# Altium schematic sheet Sheet1.SchDoc
size A2; SheetNumber: 1; SheetTotal: 1
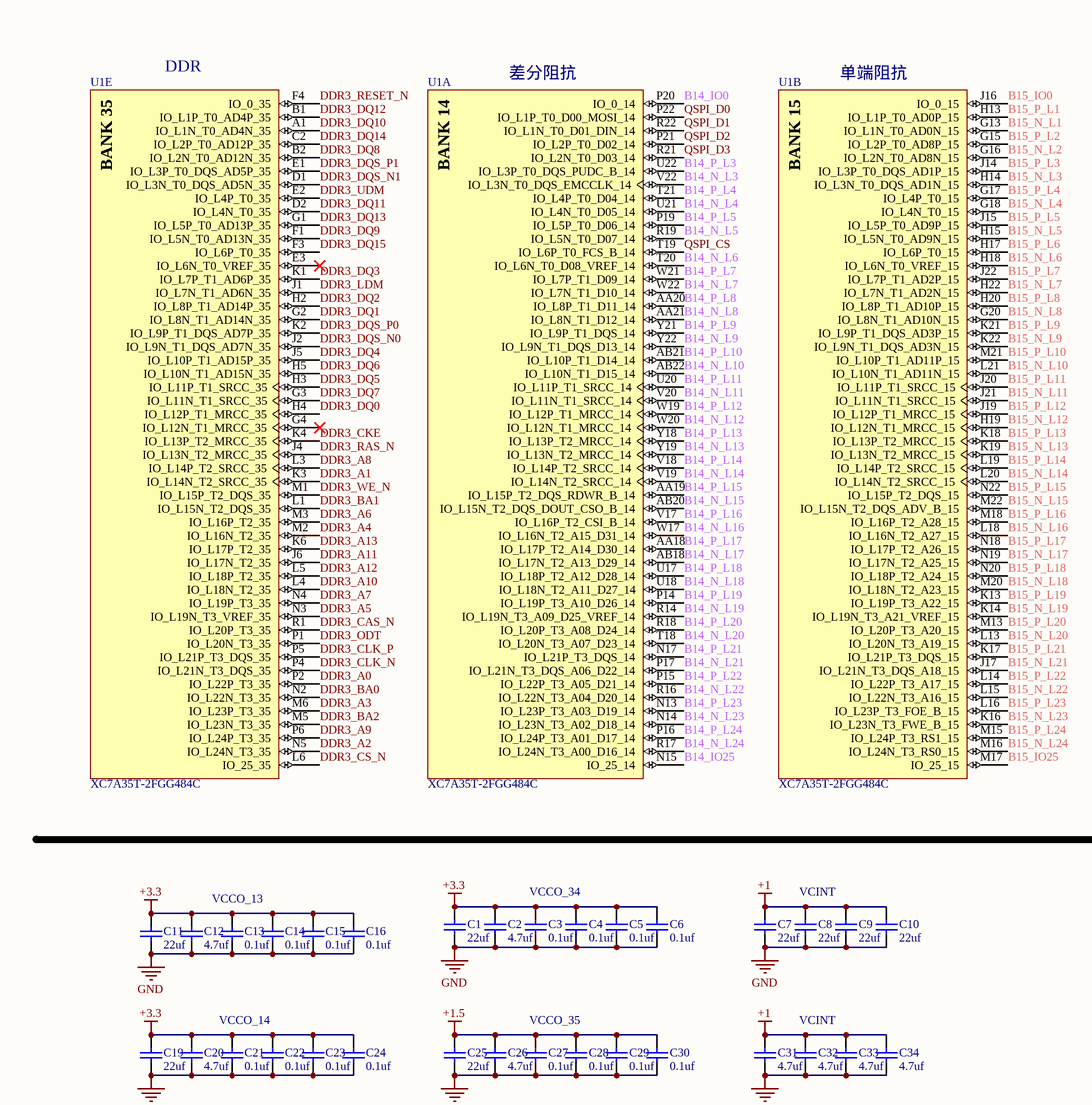
[diagram p0: Sheet1.SchDoc, top left]
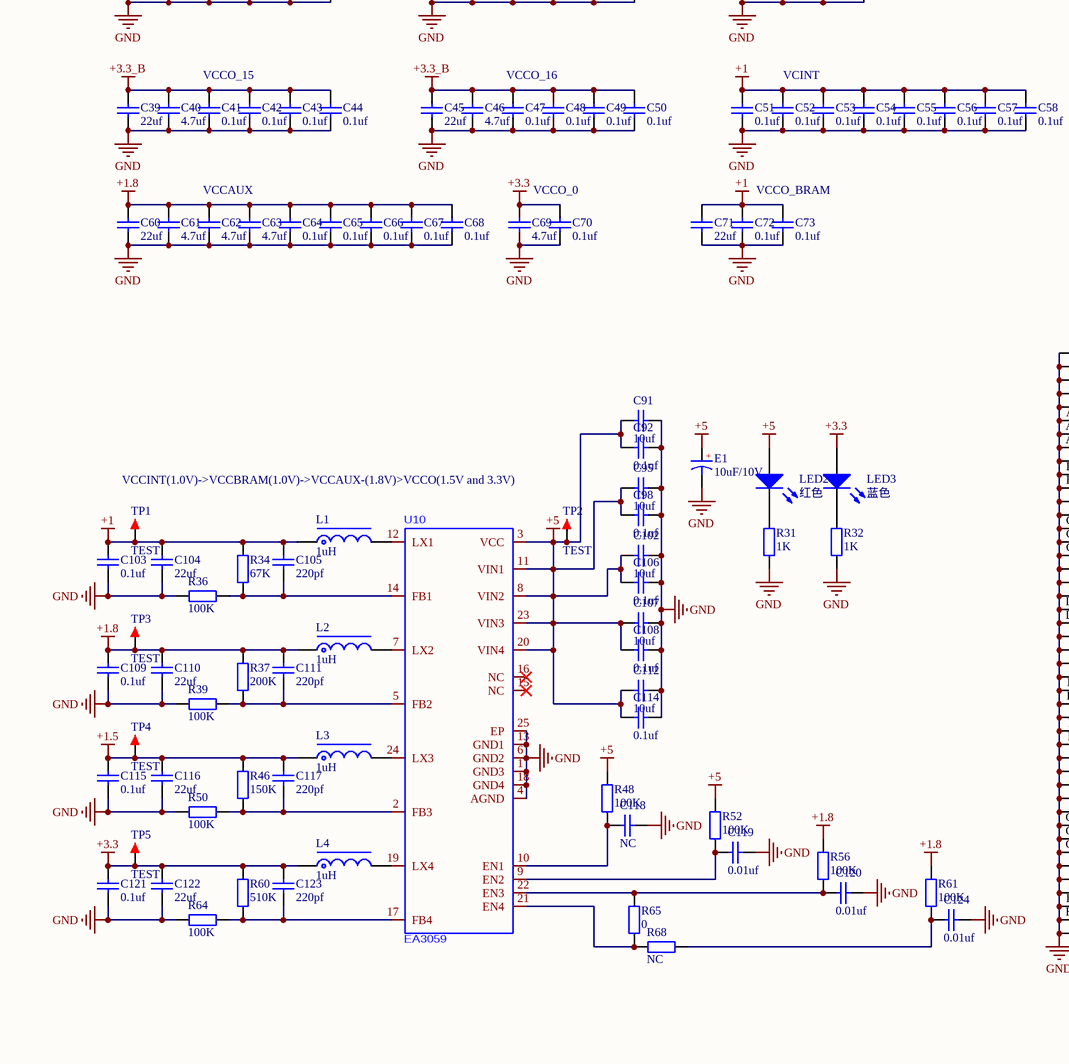
[diagram p1: Sheet1.SchDoc, bottom left]
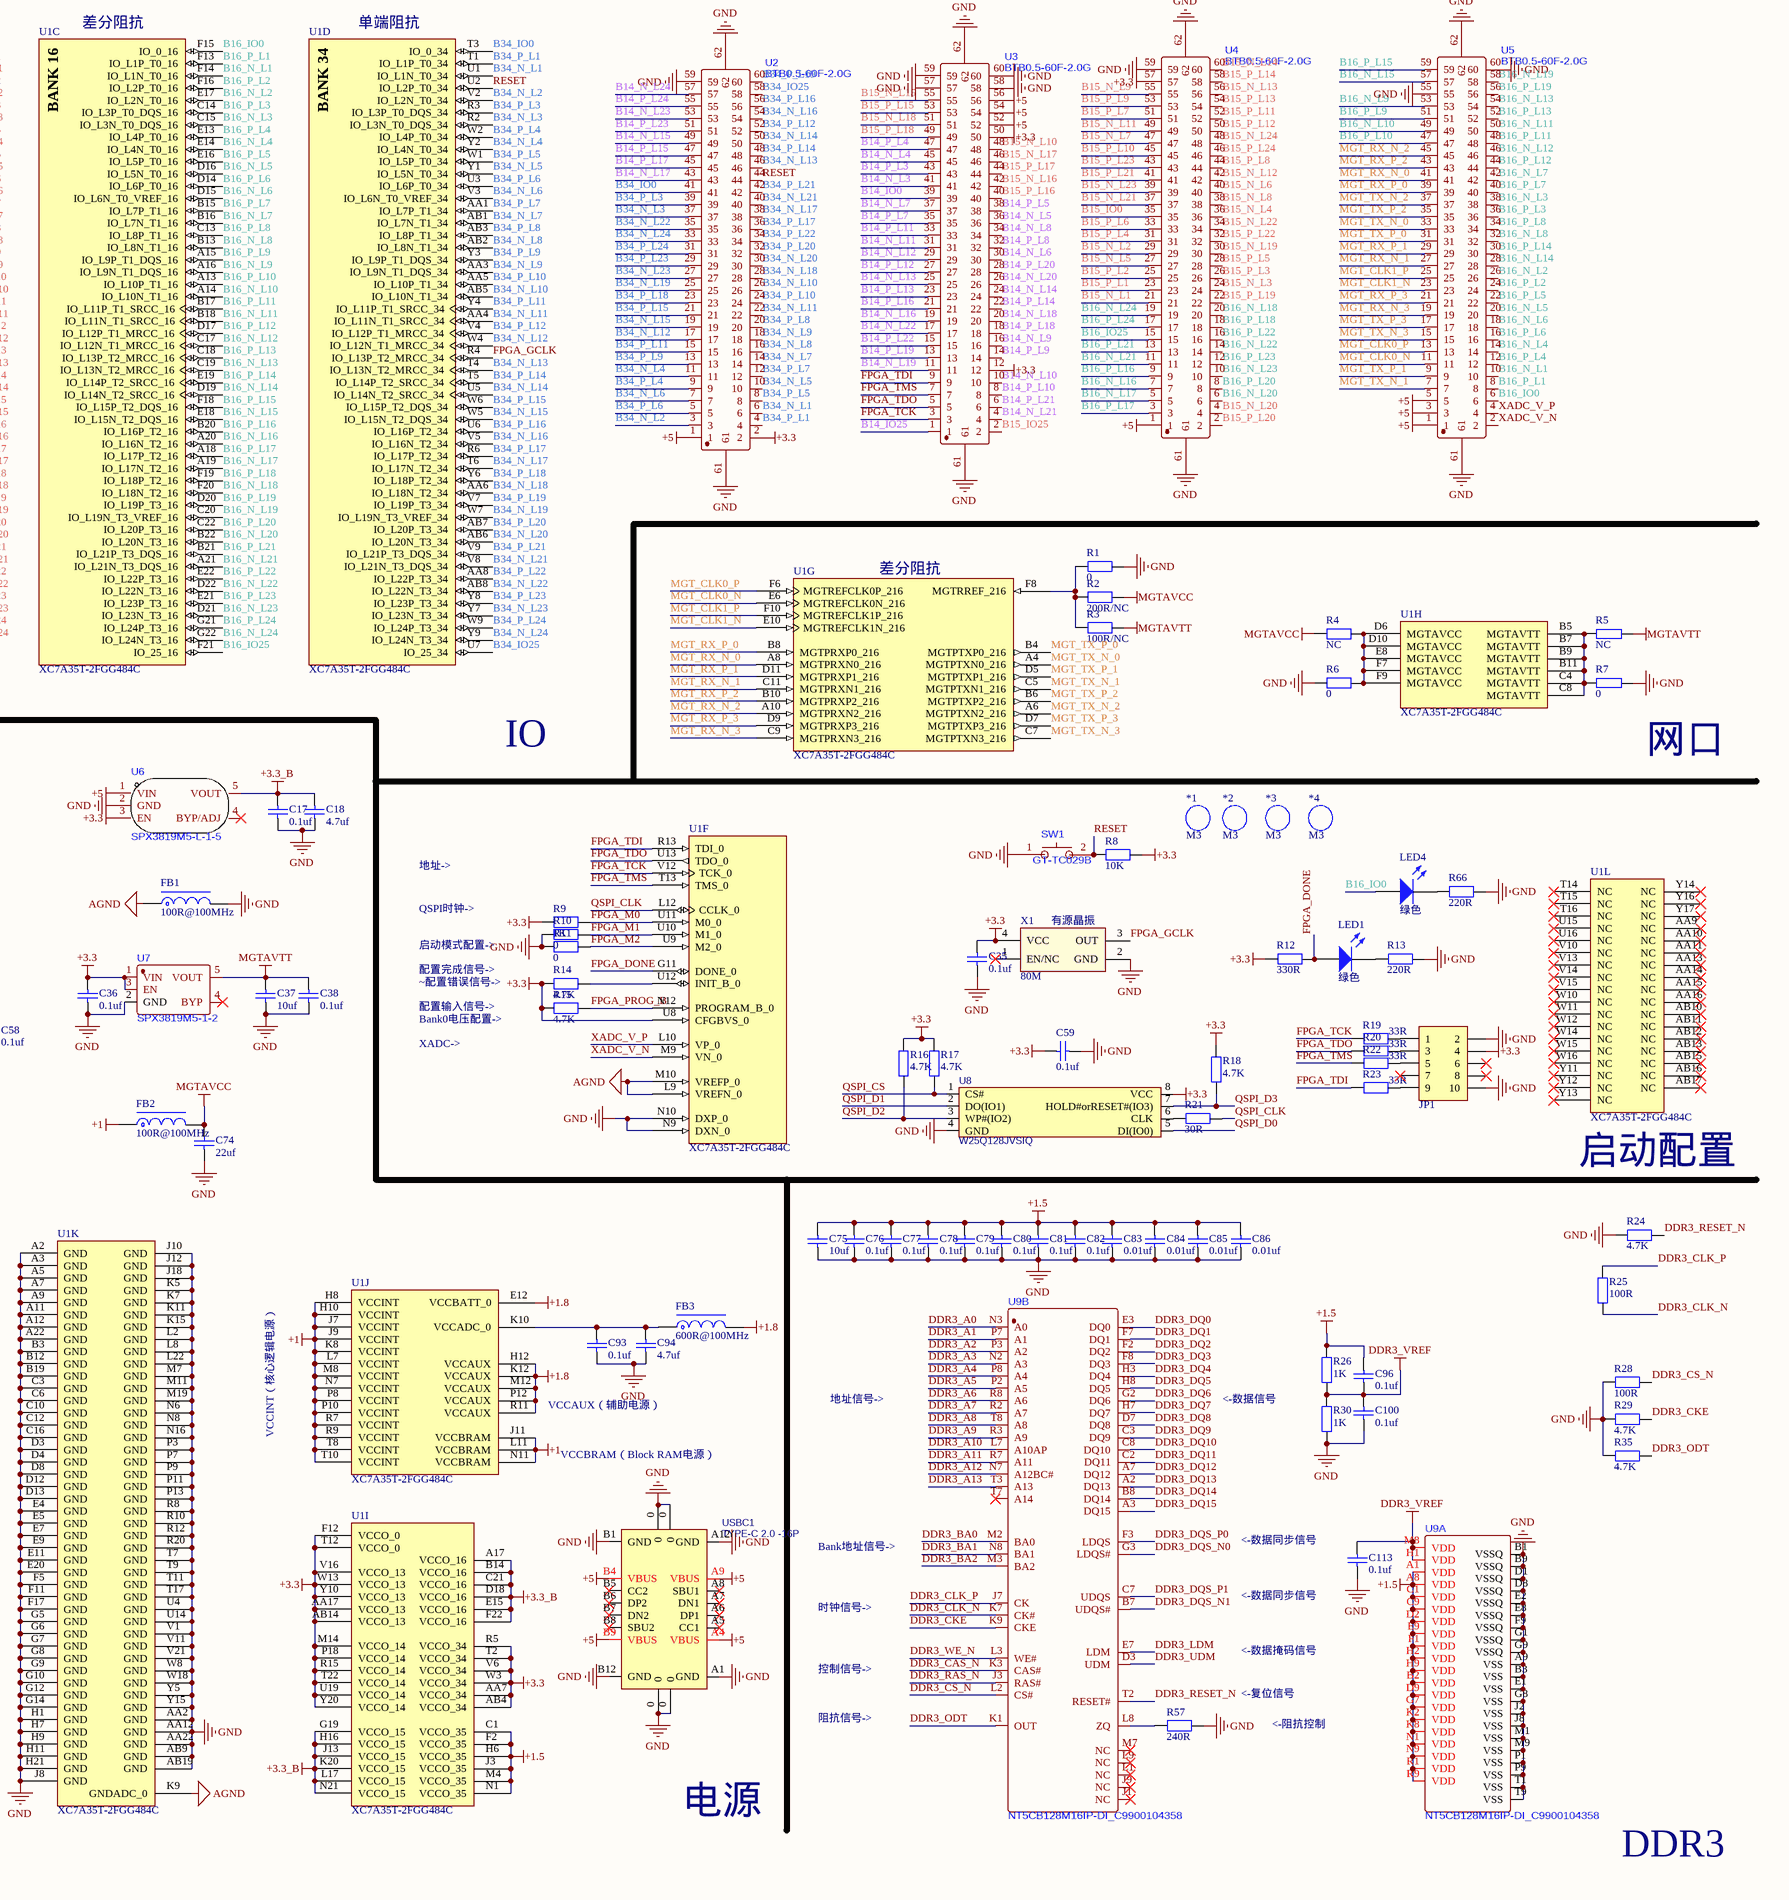
[diagram p2: Sheet1.SchDoc, bottom right]

## Parts
*1  M3  [M3 125X200]
*2  M3  [M3 125X200]
*3  M3  [M3 125X200]
*4  M3  [M3 125X200]
C1  22uf  [C0603_L]
C2  4.7uf  [C0402_L]
C3  0.1uf  [C0402_L]
C4  0.1uf  [C0402_L]
C5  0.1uf  [C0402_L]
C6  0.1uf  [C0402_L]
C7  22uf  [C0603_L]
C8  22uf  [C0603_L]
C9  22uf  [C0603_L]
C10  22uf  [C0603_L]
C11  22uf  [C0603_L]
C12  4.7uf  [C0402_L]
C13  0.1uf  [C0402_L]
C14  0.1uf  [C0402_L]
C15  0.1uf  [C0402_L]
C16  0.1uf  [C0402_L]
C17  0.1uf  [C0402_L]
C18  4.7uf  [C0402_L]
C19  22uf  [C0603_L]
C20  4.7uf  [C0402_L]
C21  0.1uf  [C0402_L]
C22  0.1uf  [C0402_L]
C23  0.1uf  [C0402_L]
C24  0.1uf  [C0402_L]
C25  22uf  [C0603_L]
C26  4.7uf  [C0402_L]
C27  0.1uf  [C0402_L]
C28  0.1uf  [C0402_L]
C29  0.1uf  [C0402_L]
C30  0.1uf  [C0402_L]
C31  4.7uf  [C0402_L]
C32  4.7uf  [C0402_L]
C33  4.7uf  [C0402_L]
C34  4.7uf  [C0402_L]
C35  0.1uf  [C0402_L]
C36  0.1uf  [C0402_L]
C37  10uf  [C0603_L]
C38  0.1uf  [C0402_L]
C39  22uf  [C0603_L]
C40  4.7uf  [C0402_L]
C41  0.1uf  [C0402_L]
C42  0.1uf  [C0402_L]
C43  0.1uf  [C0402_L]
C44  0.1uf  [C0402_L]
C45  22uf  [C0603_L]
C46  4.7uf  [C0402_L]
C47  0.1uf  [C0402_L]
C48  0.1uf  [C0402_L]
C49  0.1uf  [C0402_L]
C50  0.1uf  [C0402_L]
C51  0.1uf  [C0402_L]
C52  0.1uf  [C0402_L]
C53  0.1uf  [C0402_L]
C54  0.1uf  [C0402_L]
C55  0.1uf  [C0402_L]
C56  0.1uf  [C0402_L]
C57  0.1uf  [C0402_L]
C58  0.1uf  [C0402_L]
C59  0.1uf  [C0402_L]
C60  22uf  [C0603_L]
C61  4.7uf  [C0402_L]
C62  4.7uf  [C0402_L]
C63  4.7uf  [C0402_L]
C64  0.1uf  [C0402_L]
C65  0.1uf  [C0402_L]
C66  0.1uf  [C0402_L]
C67  0.1uf  [C0402_L]
C68  0.1uf  [C0402_L]
C69  4.7uf  [C0402_L]
C70  0.1uf  [C0402_L]
C71  22uf  [C0603_L]
C72  0.1uf  [C0402_L]
C73  0.1uf  [C0402_L]
C74  22uf  [C0603_L]
C75  10uf  [C0603_L]
C76  0.1uf  [C0402_L]
C77  0.1uf  [C0402_L]
C78  0.1uf  [C0402_L]
C79  0.1uf  [C0402_L]
C80  0.1uf  [C0402_L]
C81  0.1uf  [C0402_L]
C82  0.1uf  [C0402_L]
C83  0.01uf  [C0402_L]
C84  0.01uf  [C0402_L]
C85  0.01uf  [C0402_L]
C86  0.01uf  [C0402_L]
C91  10uf  [C0603_L]
C92  0.1uf  [C0402_L]
C93  0.1uf  [C0402_L]
C94  4.7uf  [C0402_L]
C95  10uf  [C0603_L]
C96  0.1uf  [C0402_L]
C98  0.1uf  [C0402_L]
C100  0.1uf  [C0402_L]
C102  10uf  [C0603_L]
C103  0.1uf  [C0402_L]
C104  22uf  [C0603_L]
C105  220pf  [C0402_L]
C106  0.1uf  [C0402_L]
C107  10uf  [C0603_L]
C108  0.1uf  [C0402_L]
C109  0.1uf  [C0402_L]
C110  22uf  [C0603_L]
C111  220pf  [C0402_L]
C112  10uf  [C0603_L]
C113  0.1uf  [C0402_L]
C114  0.1uf  [C0402_L]
C115  0.1uf  [C0402_L]
C116  22uf  [C0603_L]
C117  220pf  [C0402_L]
C118  NC  [C0402_L]
C119  0.01uf  [C0402_L]
C120  0.01uf  [C0402_L]
C121  0.1uf  [C0402_L]
C122  22uf  [C0603_L]
C123  220pf  [C0402_L]
C124  0.01uf  [C0402_L]
E1  10uF/10V  [CE D(6.3*7.7)]
FB1  100R@100MHz  [FB0603]
FB2  100R@100MHz  [FB0603]
FB3  600R@100MHz  [FB0603]
JP1  Header 5X2  [PHD2.0-LI-2x5P]  (value not drawn)
L1  1uH  [CD43]
L2  1uH  [CD43]
L3  1uH  [CD43]
L4  1uH  [CD43]
LED1  绿色  [LED0805_G]
LED2  红色  [LED0805_G]
LED3  蓝色  [LED0805_G]
LED4  绿色  [LED0805_G]
R1  0  [R0402_L]
R2  200R/NC  [R0402_L]
R3  100R/NC  [R0402_L]
R4  NC  [R0603_L]
R5  NC  [R0603_L]
R6  0  [R0603_L]
R7  0  [R0603_L]
R8  10K  [R0402_L]
R9  1K  [R0402_L]
R10  0  [R0402_L]
R11  0  [R0402_L]
R12  330R  [R0402_L]
R13  220R  [R0402_L]
R14  4.7K  [R0402_L]
R15  4.7K  [R0402_L]
R16  4.7K  [R0402_L]
R17  4.7K  [R0402_L]
R18  4.7K  [R0402_L]
R19  33R  [R0402_L]
R20  33R  [R0402_L]
R21  30R  [R0402_L]
R22  33R  [R0402_L]
R23  33R  [R0402_L]
R24  4.7K  [R0402_L]
R25  100R  [R0402_L]
R26  1K  [R0402_L]
R28  100R  [R0402_L]
R29  4.7K  [R0402_L]
R30  1K  [R0402_L]
R31  1K  [R0402_L]
R32  1K  [R0402_L]
R34  67K  [R0402_L]
R35  4.7K  [R0402_L]
R36  100K  [R0402_L]
R37  200K  [R0402_L]
R39  100K  [R0402_L]
R46  150K  [R0402_L]
R48  100K  [R0402_L]
R50  100K  [R0402_L]
R52  100K  [R0402_L]
R56  100K  [R0402_L]
R57  240R  [R0402_L]
R60  510K  [R0402_L]
R61  100K  [R0402_L]
R64  100K  [R0402_L]
R65  0  [R0402_L]
R66  220R  [R0402_L]
R68  NC  [R0402_L]
SW1  GT-TC029B  [SW-SMD_L3.9-W2.9-P4.15-LS5.0]
TP1  TEST  [TEST 1.6]
TP2  TEST  [TEST 1.6]
TP3  TEST  [TEST 1.6]
TP4  TEST  [TEST 1.6]
TP5  TEST  [TEST 1.6]
U1  XC7A35T-2FGG484C  [FGG484]  (parts A,B,C,D,E,F,G,H,I,J,K,L of 12)
U2  BTB0.5-60F-2.0G  [CONN-SMD_60P-P0.50_BTB0.5-60F-2.0G]
U3  BTB0.5-60F-2.0G  [CONN-SMD_60P-P0.50_BTB0.5-60F-2.0G]
U4  BTB0.5-60F-2.0G  [CONN-SMD_60P-P0.50_BTB0.5-60F-2.0G]
U5  BTB0.5-60F-2.0G  [CONN-SMD_60P-P0.50_BTB0.5-60F-2.0G]
U6  SPX3819M5-L-1-5  [SPX3819M5-L-1-5]
U7  SPX3819M5-1-2  [SOT-23-5_L2.9-W1.6-P0.95-LS2.8-BR]
U8  W25Q128JVSIQ  [SOIC-8W]
U9  NT5CB128M16IP-DI_C9900104358  [TFBGA-96_L13.0-W8.0-R16-C6-P0.80-TL]  (parts A,B of 2)
U10  EA3059  [QFN24 4X4_M]
USBC1  TYPE-C 2.0 -16P  [USB-C-SMD_16P]
X1  80M  [OSC-3225-4P]

## Nets
+1: C7.1 C8.1 C9.1 C10.1 C31.1 C32.1 C33.1 C34.1 C51.1 C52.1 C53.1 C54.1 C55.1 C56.1 C57.1 C58.1 C71.1 C72.1 C73.1 C103.1 C104.1 C105.1 FB2.1 L1.1 R34.2 TP1.1 U1.H8(VCCINT) U1.H10(VCCINT) U1.J7(VCCINT) U1.J9(VCCINT) U1.J11(VCCBRAM) U1.K8(VCCINT) U1.L7(VCCINT) U1.L11(VCCBRAM) U1.M8(VCCINT) U1.N7(VCCINT) U1.N11(VCCBRAM) U1.P8(VCCINT) U1.P10(VCCINT) U1.R7(VCCINT) U1.R9(VCCINT) U1.T8(VCCINT) U1.T10(VCCINT)
+1.5: C25.1 C26.1 C27.1 C28.1 C29.1 C30.1 C75.1 C76.2 C77.2 C78.2 C79.2 C80.2 C81.2 C82.2 C83.2 C84.2 C85.2 C86.2 C96.2 C115.1 C116.1 C117.1 L3.1 R26.2 R46.2 TP4.1 U1.C1(VCCO_35) U1.F2(VCCO_35) U1.H6(VCCO_35) U1.J3(VCCO_35) U1.M4(VCCO_35) U1.N1(VCCO_35) U9.A1(VDD) U9.A8(VDD) U9.B2(VDD) U9.C1(VDD) U9.C9(VDD) U9.D2(VDD) U9.D9(VDD) U9.E9(VDD) U9.F1(VDD) U9.G7(VDD) U9.H2(VDD) U9.H9(VDD) U9.K2(VDD) U9.K8(VDD) U9.N1(VDD) U9.N9(VDD) U9.R1(VDD) U9.R9(VDD)
+1.8: C60.1 C61.1 C62.1 C63.1 C64.1 C65.1 C66.1 C67.1 C68.1 C109.1 C110.1 C111.1 FB3.2 L2.1 R37.2 R56.2 R61.2 TP3.1 U1.E12(VCCBATT_0) U1.H12(VCCAUX) U1.K12(VCCAUX) U1.M12(VCCAUX) U1.P12(VCCAUX) U1.R11(VCCAUX)
+3.3: C1.1 C2.1 C3.1 C4.1 C5.1 C6.1 C11.1 C12.1 C13.1 C14.1 C15.1 C16.1 C19.1 C20.1 C21.1 C22.1 C23.1 C24.1 C35.2 C36.2 C59.1 C69.1 C70.1 C121.1 C122.1 C123.1 JP1.4 L4.1 LED3.1(A) R8.2 R9.1 R12.1 R14.1 R15.1 R16.2 R17.2 R18.2 R60.2 TP5.1 U1.AA7(VCCO_34) U1.AA17(VCCO_13) U1.AB4(VCCO_34) U1.AB14(VCCO_13) U1.F12(VCCO_0) U1.M14(VCCO_14) U1.P18(VCCO_14) U1.R5(VCCO_34) U1.R15(VCCO_14) U1.T2(VCCO_34) U1.T12(VCCO_0) U1.T22(VCCO_14) U1.U8(CFGBVS_0) U1.U19(VCCO_14) U1.V6(VCCO_34) U1.V16(VCCO_13) U1.W3(VCCO_34) U1.W13(VCCO_13) U1.Y10(VCCO_13) U1.Y20(VCCO_14) U2.2 U3.12 U3.50 U4.57 U6.3(EN) U7.1(VIN) U7.3(EN) U8.8(VCC) X1.4(VCC)
+3.3_B: C17.1 C18.1 C39.1 C40.1 C41.1 C42.1 C43.1 C44.1 C45.1 C46.1 C47.1 C48.1 C49.1 C50.1 U1.A17(VCCO_16) U1.B14(VCCO_16) U1.C21(VCCO_16) U1.D18(VCCO_16) U1.E15(VCCO_16) U1.F22(VCCO_16) U1.G19(VCCO_15) U1.H16(VCCO_15) U1.J13(VCCO_15) U1.K20(VCCO_15) U1.L17(VCCO_15) U1.N21(VCCO_15) U6.5(VOUT)
+5: C91.2 C92.2 C95.2 C98.2 C102.2 C106.2 C107.2 C108.2 C112.2 C114.2 E1.1 LED2.1(A) R48.2 R52.2 TP2.1 U2.1 U3.52 U3.54 U3.56 U4.1 U5.1 U5.3 U5.5 U6.1(VIN) U10.3(VCC) U10.8(VIN2) U10.11(VIN1) U10.20(VIN4) U10.23(VIN3) USBC1.A4(VBUS) USBC1.A9(VBUS) USBC1.B4(VBUS) USBC1.B9(VBUS)
AGND: FB1.1 U1.K9(GNDADC_0) U1.L9(VREFN_0) U1.M10(VREFP_0)
DDR3_VREF: C96.1 C100.2 C113.2 R26.1 R30.2 U9.H1(VDD) U9.M8(VDD)
GND: C1.2 C2.2 C3.2 C4.2 C5.2 C6.2 C7.2 C8.2 C9.2 C10.2 C11.2 C12.2 C13.2 C14.2 C15.2 C16.2 C17.2 C18.2 C19.2 C20.2 C21.2 C22.2 C23.2 C24.2 C25.2 C26.2 C27.2 C28.2 C29.2 C30.2 C31.2 C32.2 C33.2 C34.2 C35.1 C36.1 C37.2 C38.1 C39.2 C40.2 C41.2 C42.2 C43.2 C44.2 C45.2 C46.2 C47.2 C48.2 C49.2 C50.2 C51.2 C52.2 C53.2 C54.2 C55.2 C56.2 C57.2 C58.2 C59.2 C60.2 C61.2 C62.2 C63.2 C64.2 C65.2 C66.2 C67.2 C68.2 C69.2 C70.2 C71.2 C72.2 C73.2 C74.2 C75.2 C76.1 C77.1 C78.1 C79.1 C80.1 C81.1 C82.1 C83.1 C84.1 C85.1 C86.1 C91.1 C92.1 C93.2 C94.2 C95.1 C98.1 C100.1 C102.1 C103.2 C104.2 C106.1 C107.1 C108.1 C109.2 C110.2 C112.1 C113.1 C114.1 C115.2 C116.2 C118.1 C119.1 C120.1 C121.2 C122.2 C124.1 E1.2 FB1.2 JP1.2 JP1.10 R1.1 R6.1 R7.1 R10.1 R11.1 R13.2 R24.2 R28.2 R29.2 R30.1 R31.2 R32.2 R35.2 R36.2 R39.2 R50.2 R57.1 R64.2 R66.2 SW1.1 U1.A2(GND) U1.A3(GND) U1.A5(GND) U1.A7(GND) U1.A9(GND) U1.A11(GND) U1.A12(GND) U1.A22(GND) U1.AA2(GND) U1.AA12(GND) U1.AA22(GND) U1.AB9(GND) U1.AB19(GND) U1.B3(GND) U1.B12(GND) U1.B19(GND) U1.C3(GND) U1.C6(GND) U1.C10(GND) U1.C12(GND) U1.C16(GND) U1.D3(GND) U1.D4(GND) U1.D8(GND) U1.D12(GND) U1.D13(GND) U1.E4(GND) U1.E5(GND) U1.E7(GND) U1.E9(GND) U1.E11(GND) U1.E20(GND) U1.F5(GND) U1.F11(GND) U1.F17(GND) U1.G5(GND) U1.G6(GND) U1.G7(GND) U1.G8(GND) U1.G9(GND) U1.G10(GND) U1.G12(GND) U1.G14(GND) U1.H1(GND) U1.H7(GND) U1.H9(GND) U1.H11(GND) U1.H21(GND) U1.J8(GND) U1.J10(GND) U1.J12(GND) U1.J18(GND) U1.K5(GND) U1.K7(GND) U1.K11(GND) U1.K15(GND) U1.L2(GND) U1.L8(GND) U1.L22(GND) U1.M7(GND) U1.M11(GND) U1.M19(GND) U1.N6(GND) U1.N8(GND) U1.N9(DXN_0) U1.N10(DXP_0) U1.N16(GND) U1.P3(GND) U1.P7(GND) U1.P9(GND) U1.P11(GND) U1.P13(GND) U1.R8(GND) U1.R10(GND) U1.R12(GND) U1.R20(GND) U1.T7(GND) U1.T9(GND) U1.T11(GND) U1.T17(GND) U1.U4(GND) U1.U14(GND) U1.V1(GND) U1.V11(GND) U1.V21(GND) U1.W8(GND) U1.W18(GND) U1.Y5(GND) U1.Y15(GND) U2.59 U2.61 U2.62 U3.57 U3.58 U3.59 U3.60 U3.61 U3.62 U4.59 U4.61 U4.62 U5.55 U5.60 U5.61 U5.62 U6.2(GND) U7.2(GND) U8.4(GND) U9.A9(VSS) U9.B1(VSSQ) U9.B3(VSS) U9.B9(VSSQ) U9.D1(VSSQ) U9.D8(VSSQ) U9.E1(VSS) U9.E2(VSSQ) U9.E8(VSSQ) U9.F9(VSSQ) U9.G1(VSSQ) U9.G8(VSS) U9.G9(VSSQ) U9.J2(VSS) U9.J8(VSS) U9.M1(VSS) U9.M9(VSS) U9.P1(VSS) U9.P9(VSS) U9.T1(VSS) U9.T9(VSS) U10.1(GND3) U10.4(AGND) U10.6(GND2) U10.13(GND1) U10.18(GND4) U10.25(EP) USBC1.0 USBC1.A1(GND) USBC1.A12(GND) USBC1.B1(GND) USBC1.B12(GND) X1.2(GND)
MGTAVCC: C74.1 FB2.2 R2.1 R4.1
MGTAVTT: C37.1 C38.2 R3.1 R5.1 U7.5(VOUT)
B14_IO0: U1.P20(IO_0_14) U3.39
B14_IO25: U1.N15(IO_25_14) U3.1
B14_N_L3: U1.V22(IO_L3N_T0_DQS_EMCCLK_14) U3.41
B14_N_L4: U1.U21(IO_L4N_T0_D05_14) U3.45
B14_N_L5: U1.R19(IO_L5N_T0_D07_14) U3.36
B14_N_L6: U1.T20(IO_L6N_T0_D08_VREF_14) U3.30
B14_N_L7: U1.W22(IO_L7N_T1_D10_14) U3.37
B14_N_L8: U1.AA21(IO_L8N_T1_D12_14) U3.34
B14_N_L9: U1.Y22(IO_L9N_T1_DQS_D13_14) U3.16
B14_N_L10: U1.AB22(IO_L10N_T1_D15_14) U3.10
B14_N_L11: U1.V20(IO_L11N_T1_SRCC_14) U3.31
B14_N_L12: U1.W20(IO_L12N_T1_MRCC_14) U3.29
B14_N_L13: U1.Y19(IO_L13N_T2_MRCC_14) U3.25
B14_N_L14: U1.V19(IO_L14N_T2_SRCC_14) U3.24
B14_N_L15: U1.AB20(IO_L15N_T2_DQS_DOUT_CSO_B_14) U2.49
B14_N_L16: U1.W17(IO_L16N_T2_A15_D31_14) U3.19
B14_N_L17: U1.AB18(IO_L17N_T2_A13_D29_14) U2.43
B14_N_L18: U1.U18(IO_L18N_T2_A11_D27_14) U3.20
B14_N_L19: U1.R14(IO_L19N_T3_A09_D25_VREF_14) U3.11
B14_N_L20: U1.T18(IO_L20N_T3_A07_D23_14) U3.26
B14_N_L21: U1.P17(IO_L21N_T3_DQS_A06_D22_14) U3.4
B14_N_L22: U1.R16(IO_L22N_T3_A04_D20_14) U3.17
B14_N_L23: U1.N14(IO_L23N_T3_A02_D18_14) U2.53
B14_N_L24: U1.R17(IO_L24N_T3_A00_D16_14) U2.57
B14_P_L3: U1.U22(IO_L3P_T0_DQS_PUDC_B_14) U3.43
B14_P_L4: U1.T21(IO_L4P_T0_D04_14) U3.47
B14_P_L5: U1.P19(IO_L5P_T0_D06_14) U3.38
B14_P_L7: U1.W21(IO_L7P_T1_D09_14) U3.35
B14_P_L8: U1.AA20(IO_L8P_T1_D11_14) U3.32
B14_P_L9: U1.Y21(IO_L9P_T1_DQS_14) U3.14
B14_P_L10: U1.AB21(IO_L10P_T1_D14_14) U3.8
B14_P_L11: U1.U20(IO_L11P_T1_SRCC_14) U3.33
B14_P_L12: U1.W19(IO_L12P_T1_MRCC_14) U3.27
B14_P_L13: U1.Y18(IO_L13P_T2_MRCC_14) U3.23
B14_P_L14: U1.V18(IO_L14P_T2_SRCC_14) U3.22
B14_P_L15: U1.AA19(IO_L15P_T2_DQS_RDWR_B_14) U2.47
B14_P_L16: U1.V17(IO_L16P_T2_CSI_B_14) U3.21
B14_P_L17: U1.AA18(IO_L17P_T2_A14_D30_14) U2.45
B14_P_L18: U1.U17(IO_L18P_T2_A12_D28_14) U3.18
B14_P_L19: U1.P14(IO_L19P_T3_A10_D26_14) U3.13
B14_P_L20: U1.R18(IO_L20P_T3_A08_D24_14) U3.28
B14_P_L21: U1.N17(IO_L21P_T3_DQS_14) U3.6
B14_P_L22: U1.P15(IO_L22P_T3_A05_D21_14) U3.15
B14_P_L23: U1.N13(IO_L23P_T3_A03_D19_14) U2.51
B14_P_L24: U1.P16(IO_L24P_T3_A01_D17_14) U2.55
B15_IO0: U1.J16(IO_0_15) U4.35
B15_IO25: U1.M17(IO_25_15) U3.2
B15_N_L1: U1.G13(IO_L1N_T0_AD0N_15) U4.21
B15_N_L2: U1.G16(IO_L2N_T0_AD8N_15) U4.29
B15_N_L3: U1.H14(IO_L3N_T0_DQS_AD1N_15) U4.24
B15_N_L4: U1.G18(IO_L4N_T0_15) U4.36
B15_N_L5: U1.H15(IO_L5N_T0_AD9N_15) U4.27
B15_N_L6: U1.H18(IO_L6N_T0_VREF_15) U4.40
B15_N_L7: U1.H22(IO_L7N_T1_AD2N_15) U4.47
B15_N_L8: U1.G20(IO_L8N_T1_AD10N_15) U4.38
B15_N_L9: U1.K22(IO_L9N_T1_DQS_AD3N_15) U4.55
B15_N_L10: U1.L21(IO_L10N_T1_AD11N_15) U3.48
B15_N_L11: U1.J21(IO_L11N_T1_SRCC_15) U4.49
B15_N_L12: U1.H19(IO_L12N_T1_MRCC_15) U4.42
B15_N_L13: U1.K19(IO_L13N_T2_MRCC_15) U4.56
B15_N_L14: U1.L20(IO_L14N_T2_SRCC_15) U4.60
B15_N_L15: U1.M22(IO_L15N_T2_DQS_ADV_B_15) U3.55
B15_N_L16: U1.L18(IO_L16N_T2_A27_15) U3.42
B15_N_L17: U1.N19(IO_L17N_T2_A25_15) U3.46
B15_N_L18: U1.M20(IO_L18N_T2_A23_15) U3.51
B15_N_L19: U1.K14(IO_L19N_T3_A21_VREF_15) U4.30
B15_N_L20: U1.L13(IO_L20N_T3_A19_15) U4.4
B15_N_L21: U1.J17(IO_L21N_T3_DQS_A18_15) U4.37
B15_N_L22: U1.L15(IO_L22N_T3_A16_15) U4.34
B15_N_L23: U1.K16(IO_L23N_T3_FWE_B_15) U4.39
B15_N_L24: U1.M16(IO_L24N_T3_RS0_15) U4.48
B15_P_L1: U1.H13(IO_L1P_T0_AD0P_15) U4.23
B15_P_L2: U1.G15(IO_L2P_T0_AD8P_15) U4.25
B15_P_L3: U1.J14(IO_L3P_T0_DQS_AD1P_15) U4.26
B15_P_L4: U1.G17(IO_L4P_T0_15) U4.31
B15_P_L5: U1.J15(IO_L5P_T0_AD9P_15) U4.28
B15_P_L6: U1.H17(IO_L6P_T0_15) U4.33
B15_P_L7: U1.J22(IO_L7P_T1_AD2P_15) U4.51
B15_P_L8: U1.H20(IO_L8P_T1_AD10P_15) U4.44
B15_P_L9: U1.K21(IO_L9P_T1_DQS_AD3P_15) U4.53
B15_P_L10: U1.M21(IO_L10P_T1_AD11P_15) U4.45
B15_P_L11: U1.J20(IO_L11P_T1_SRCC_15) U4.52
B15_P_L12: U1.J19(IO_L12P_T1_MRCC_15) U4.50
B15_P_L13: U1.K18(IO_L13P_T2_MRCC_15) U4.54
B15_P_L14: U1.L19(IO_L14P_T2_SRCC_15) U4.58
B15_P_L15: U1.N22(IO_L15P_T2_DQS_15) U3.53
B15_P_L16: U1.M18(IO_L16P_T2_A28_15) U3.40
B15_P_L17: U1.N18(IO_L17P_T2_A26_15) U3.44
B15_P_L18: U1.N20(IO_L18P_T2_A24_15) U3.49
B15_P_L19: U1.K13(IO_L19P_T3_A22_15) U4.22
B15_P_L20: U1.M13(IO_L20P_T3_A20_15) U4.2
B15_P_L21: U1.K17(IO_L21P_T3_DQS_15) U4.41
B15_P_L22: U1.L14(IO_L22P_T3_A17_15) U4.32
B15_P_L23: U1.L16(IO_L23P_T3_FOE_B_15) U4.43
B15_P_L24: U1.M15(IO_L24P_T3_RS1_15) U4.46
B16_IO0: LED4.1(A) U1.F15(IO_0_16) U5.6
B16_IO25: U1.F21(IO_25_16) U4.15
B16_N_L1: U1.F14(IO_L1N_T0_16) U5.10
B16_N_L2: U1.E17(IO_L2N_T0_16) U5.26
B16_N_L3: U1.C15(IO_L3N_T0_DQS_16) U5.38
B16_N_L4: U1.E14(IO_L4N_T0_16) U5.14
B16_N_L5: U1.D16(IO_L5N_T0_16) U5.20
B16_N_L6: U1.D15(IO_L6N_T0_VREF_16) U5.18
B16_N_L7: U1.B16(IO_L7N_T1_16) U5.42
B16_N_L8: U1.B13(IO_L8N_T1_16) U5.32
B16_N_L9: U1.A16(IO_L9N_T1_DQS_16) U5.53
B16_N_L10: U1.A14(IO_L10N_T1_16) U5.49
B16_N_L11: U1.B18(IO_L11N_T1_SRCC_16) U5.50
B16_N_L12: U1.C17(IO_L12N_T1_MRCC_16) U5.46
B16_N_L13: U1.C19(IO_L13N_T2_MRCC_16) U5.54
B16_N_L14: U1.D19(IO_L14N_T2_SRCC_16) U5.28
B16_N_L15: U1.E18(IO_L15N_T2_DQS_16) U5.57
B16_N_L16: U1.A20(IO_L16N_T2_16) U4.7
B16_N_L17: U1.A19(IO_L17N_T2_16) U4.5
B16_N_L18: U1.F20(IO_L18N_T2_16) U4.20
B16_N_L19: U1.C20(IO_L19N_T3_VREF_16) U5.58
B16_N_L20: U1.B22(IO_L20N_T3_16) U4.6
B16_N_L21: U1.A21(IO_L21N_T3_DQS_16) U4.11
B16_N_L22: U1.D22(IO_L22N_T3_16) U4.14
B16_N_L23: U1.D21(IO_L23N_T3_16) U4.10
B16_N_L24: U1.G22(IO_L24N_T3_16) U4.19
B16_P_L1: U1.F13(IO_L1P_T0_16) U5.8
B16_P_L2: U1.F16(IO_L2P_T0_16) U5.24
B16_P_L3: U1.C14(IO_L3P_T0_DQS_16) U5.36
B16_P_L4: U1.E13(IO_L4P_T0_16) U5.12
B16_P_L5: U1.E16(IO_L5P_T0_16) U5.22
B16_P_L6: U1.D14(IO_L6P_T0_16) U5.16
B16_P_L7: U1.B15(IO_L7P_T1_16) U5.40
B16_P_L8: U1.C13(IO_L8P_T1_16) U5.34
B16_P_L9: U1.A15(IO_L9P_T1_DQS_16) U5.51
B16_P_L10: U1.A13(IO_L10P_T1_16) U5.47
B16_P_L11: U1.B17(IO_L11P_T1_SRCC_16) U5.48
B16_P_L12: U1.D17(IO_L12P_T1_MRCC_16) U5.44
B16_P_L13: U1.C18(IO_L13P_T2_MRCC_16) U5.52
B16_P_L14: U1.E19(IO_L14P_T2_SRCC_16) U5.30
B16_P_L15: U1.F18(IO_L15P_T2_DQS_16) U5.59
B16_P_L16: U1.B20(IO_L16P_T2_16) U4.9
B16_P_L17: U1.A18(IO_L17P_T2_16) U4.3
B16_P_L18: U1.F19(IO_L18P_T2_16) U4.18
B16_P_L19: U1.D20(IO_L19P_T3_16) U5.56
B16_P_L20: U1.C22(IO_L20P_T3_16) U4.8
B16_P_L21: U1.B21(IO_L21P_T3_DQS_16) U4.13
B16_P_L22: U1.E22(IO_L22P_T3_16) U4.16
B16_P_L23: U1.E21(IO_L23P_T3_16) U4.12
B16_P_L24: U1.G21(IO_L24P_T3_16) U4.17
B34_IO0: U1.T3(IO_0_34) U2.41
B34_IO25: U1.U7(IO_25_34) U2.58
B34_N_L1: U1.U1(IO_L1N_T0_34) U2.6
B34_N_L2: U1.V2(IO_L2N_T0_34) U2.3
B34_N_L3: U1.R2(IO_L3N_T0_DQS_34) U2.37
B34_N_L4: U1.Y2(IO_L4N_T0_34) U2.11
B34_N_L5: U1.Y1(IO_L5N_T0_34) U2.10
B34_N_L6: U1.V3(IO_L6N_T0_VREF_34) U2.7
B34_N_L7: U1.AB1(IO_L7N_T1_34) U2.14
B34_N_L8: U1.AB2(IO_L8N_T1_34) U2.16
B34_N_L9: U1.AA3(IO_L9N_T1_DQS_34) U2.18
B34_N_L10: U1.AB5(IO_L10N_T1_34) U2.26
B34_N_L11: U1.AA4(IO_L11N_T1_SRCC_34) U2.22
B34_N_L12: U1.W4(IO_L12N_T1_MRCC_34) U2.17
B34_N_L13: U1.T4(IO_L13N_T2_MRCC_34) U2.46
B34_N_L14: U1.U5(IO_L14N_T2_SRCC_34) U2.50
B34_N_L15: U1.W5(IO_L15N_T2_DQS_34) U2.19
B34_N_L16: U1.V5(IO_L16N_T2_34) U2.54
B34_N_L17: U1.T6(IO_L17N_T2_34) U2.38
B34_N_L18: U1.AA6(IO_L18N_T2_34) U2.28
B34_N_L19: U1.W7(IO_L19N_T3_VREF_34) U2.25
B34_N_L20: U1.AB6(IO_L20N_T3_34) U2.30
B34_N_L21: U1.V8(IO_L21N_T3_DQS_34) U2.40
B34_N_L22: U1.AB8(IO_L22N_T3_34) U2.35
B34_N_L23: U1.Y7(IO_L23N_T3_34) U2.27
B34_N_L24: U1.Y9(IO_L24N_T3_34) U2.33
B34_P_L1: U1.T1(IO_L1P_T0_34) U2.4
B34_P_L3: U1.R3(IO_L3P_T0_DQS_34) U2.39
B34_P_L4: U1.W2(IO_L4P_T0_34) U2.9
B34_P_L5: U1.W1(IO_L5P_T0_34) U2.8
B34_P_L6: U1.U3(IO_L6P_T0_34) U2.5
B34_P_L7: U1.AA1(IO_L7P_T1_34) U2.12
B34_P_L8: U1.AB3(IO_L8P_T1_34) U2.20
B34_P_L9: U1.Y3(IO_L9P_T1_DQS_34) U2.13
B34_P_L10: U1.AA5(IO_L10P_T1_34) U2.24
B34_P_L11: U1.Y4(IO_L11P_T1_SRCC_34) U2.15
B34_P_L12: U1.V4(IO_L12P_T1_MRCC_34) U2.52
B34_P_L14: U1.T5(IO_L14P_T2_SRCC_34) U2.48
B34_P_L15: U1.W6(IO_L15P_T2_DQS_34) U2.21
B34_P_L16: U1.U6(IO_L16P_T2_34) U2.56
B34_P_L17: U1.R6(IO_L17P_T2_34) U2.36
B34_P_L18: U1.Y6(IO_L18P_T2_34) U2.23
B34_P_L19: U1.V7(IO_L19P_T3_34) U2.60
B34_P_L20: U1.AB7(IO_L20P_T3_34) U2.32
B34_P_L21: U1.V9(IO_L21P_T3_DQS_34) U2.42
B34_P_L22: U1.AA8(IO_L22P_T3_34) U2.34
B34_P_L23: U1.Y8(IO_L23P_T3_34) U2.29
B34_P_L24: U1.W9(IO_L24P_T3_34) U2.31
DDR3_A0: U1.P2(IO_L22P_T3_35) U9.N3(A0)
DDR3_A1: U1.K3(IO_L14N_T2_SRCC_35) U9.P7(A1)
DDR3_A2: U1.N5(IO_L24N_T3_35) U9.P3(A2)
DDR3_A3: U1.M6(IO_L23P_T3_35) U9.N2(A3)
DDR3_A4: U1.M2(IO_L16N_T2_35) U9.P8(A4)
DDR3_A5: U1.N3(IO_L19N_T3_VREF_35) U9.P2(A5)
DDR3_A6: U1.M3(IO_L16P_T2_35) U9.R8(A6)
DDR3_A7: U1.N4(IO_L19P_T3_35) U9.R2(A7)
DDR3_A8: U1.L3(IO_L14P_T2_SRCC_35) U9.T8(A8)
DDR3_A9: U1.P6(IO_L24P_T3_35) U9.R3(A9)
DDR3_A10: U1.L4(IO_L18N_T2_35) U9.L7(A10AP)
DDR3_A11: U1.J6(IO_L17N_T2_35) U9.R7(A11)
DDR3_A12: U1.L5(IO_L18P_T2_35) U9.N7(A12BC#)
DDR3_A13: U1.K6(IO_L17P_T2_35) U9.T3(A13)
DDR3_BA0: U1.N2(IO_L22N_T3_35) U9.M2(BA0)
DDR3_BA1: U1.L1(IO_L15N_T2_DQS_35) U9.N8(BA1)
DDR3_BA2: U1.M5(IO_L23N_T3_35) U9.M3(BA2)
DDR3_CAS_N: U1.R1(IO_L20P_T3_35) U9.K3(CAS#)
DDR3_CKE: R29.1 U1.K4(IO_L13P_T2_MRCC_35) U9.K9(CKE)
DDR3_CLK_N: R25.1 U1.P4(IO_L21N_T3_DQS_35) U9.K7(CK#)
DDR3_CLK_P: R25.2 U1.P5(IO_L21P_T3_DQS_35) U9.J7(CK)
DDR3_CS_N: R28.1 U1.L6(IO_25_35) U9.L2(CS#)
DDR3_DQ0: U1.H4(IO_L12P_T1_MRCC_35) U9.E3(DQ0)
DDR3_DQ1: U1.G2(IO_L8N_T1_AD14N_35) U9.F7(DQ1)
DDR3_DQ2: U1.H2(IO_L8P_T1_AD14P_35) U9.F2(DQ2)
DDR3_DQ3: U1.K1(IO_L7P_T1_AD6P_35) U9.F8(DQ3)
DDR3_DQ4: U1.J5(IO_L10P_T1_AD15P_35) U9.H3(DQ4)
DDR3_DQ5: U1.H3(IO_L11P_T1_SRCC_35) U9.H8(DQ5)
DDR3_DQ6: U1.H5(IO_L10N_T1_AD15N_35) U9.G2(DQ6)
DDR3_DQ7: U1.G3(IO_L11N_T1_SRCC_35) U9.H7(DQ7)
DDR3_DQ8: U1.B2(IO_L2N_T0_AD12N_35) U9.D7(DQ8)
DDR3_DQ9: U1.F1(IO_L5N_T0_AD13N_35) U9.C3(DQ9)
DDR3_DQ10: U1.A1(IO_L1N_T0_AD4N_35) U9.C8(DQ10)
DDR3_DQ11: U1.D2(IO_L4N_T0_35) U9.C2(DQ11)
DDR3_DQ12: U1.B1(IO_L1P_T0_AD4P_35) U9.A7(DQ12)
DDR3_DQ13: U1.G1(IO_L5P_T0_AD13P_35) U9.A2(DQ13)
DDR3_DQ14: U1.C2(IO_L2P_T0_AD12P_35) U9.B8(DQ14)
DDR3_DQ15: U1.F3(IO_L6P_T0_35) U9.A3(DQ15)
DDR3_DQS_N0: U1.J2(IO_L9N_T1_DQS_AD7N_35) U9.G3(LDQS#)
DDR3_DQS_N1: U1.D1(IO_L3N_T0_DQS_AD5N_35) U9.B7(UDQS#)
DDR3_DQS_P0: U1.K2(IO_L9P_T1_DQS_AD7P_35) U9.F3(LDQS)
DDR3_DQS_P1: U1.E1(IO_L3P_T0_DQS_AD5P_35) U9.C7(UDQS)
DDR3_LDM: U1.J1(IO_L7N_T1_AD6N_35) U9.E7(LDM)
DDR3_ODT: R35.1 U1.P1(IO_L20N_T3_35) U9.K1(OUT)
DDR3_RAS_N: U1.J4(IO_L13N_T2_MRCC_35) U9.J3(RAS#)
DDR3_RESET_N: R24.1 U1.F4(IO_0_35) U9.T2(RESET#)
DDR3_UDM: U1.E2(IO_L4P_T0_35) U9.D3(UDM)
DDR3_WE_N: U1.M1(IO_L15P_T2_DQS_35) U9.L3(WE#)
FPGA_DONE: LED1.1(A) R12.2 U1.G11(DONE_0)
FPGA_GCLK: U1.R4(IO_L13P_T2_MRCC_34) X1.3(OUT)
FPGA_M0: R9.2 U1.U11(M0_0)
FPGA_M1: R10.2 U1.U10(M1_0)
FPGA_M2: R11.2 U1.U9(M2_0)
FPGA_PROG_B: R15.2 U1.N12(PROGRAM_B_0)
FPGA_TCK: R19.1 U1.V12(TCK_0) U3.3
FPGA_TDI: R23.1 U1.R13(TDI_0) U3.9
FPGA_TDO: R20.1 U1.U13(TDO_0) U3.5
FPGA_TMS: R22.1 U1.T13(TMS_0) U3.7
MGT_CLK0_N: U1.E6(MGTREFCLK0N_216) U5.11
MGT_CLK0_P: U1.F6(MGTREFCLK0P_216) U5.13
MGT_CLK1_N: U1.E10(MGTREFCLK1N_216) U5.23
MGT_CLK1_P: U1.F10(MGTREFCLK1P_216) U5.25
MGT_RX_N_0: U1.A8(MGTPRXN0_216) U5.41
MGT_RX_N_1: U1.C11(MGTPRXN1_216) U5.27
MGT_RX_N_2: U1.A10(MGTPRXN2_216) U5.45
MGT_RX_N_3: U1.C9(MGTPRXN3_216) U5.19
MGT_RX_P_0: U1.B8(MGTPRXP0_216) U5.39
MGT_RX_P_1: U1.D11(MGTPRXP1_216) U5.29
MGT_RX_P_2: U1.B10(MGTPRXP2_216) U5.43
MGT_RX_P_3: U1.D9(MGTPRXP3_216) U5.21
MGT_TX_N_0: U1.A4(MGTPTXN0_216) U5.33
MGT_TX_N_1: U1.C5(MGTPTXN1_216) U5.7
MGT_TX_N_2: U1.A6(MGTPTXN2_216) U5.37
MGT_TX_N_3: U1.C7(MGTPTXN3_216) U5.15
MGT_TX_P_0: U1.B4(MGTPTXP0_216) U5.31
MGT_TX_P_1: U1.D5(MGTPTXP1_216) U5.9
MGT_TX_P_2: U1.B6(MGTPTXP2_216) U5.35
MGT_TX_P_3: U1.D7(MGTPTXP3_216) U5.17
QSPI_CLK: R21.2 U1.L12(CCLK_0)
QSPI_CS: R17.1 U1.T19(IO_L6P_T0_FCS_B_14) U8.1(CS#)
QSPI_D0: U1.P22(IO_L1P_T0_D00_MOSI_14) U8.5(DI(IO0))
QSPI_D1: U1.R22(IO_L1N_T0_D01_DIN_14) U8.2(DO(IO1))
QSPI_D2: R16.1 U1.P21(IO_L2P_T0_D02_14) U8.3(WP#(IO2))
QSPI_D3: R18.1 U1.R21(IO_L2N_T0_D03_14) U8.7(HOLD#orRESET#(IO3))
RESET: R8.1 SW1.2 U1.U2(IO_L2P_T0_34) U2.44
XADC_V_N: U1.M9(VN_0) U5.2
XADC_V_P: U1.L10(VP_0) U5.4
NetC93_1: C93.1 C94.1 FB3.1 U1.K10(VCCADC_0)
NetC105_2: C105.2 R34.1 R36.1 U10.14(FB1)
NetC111_2: C111.2 R37.1 R39.1 U10.5(FB2)
NetC117_2: C117.2 R46.1 R50.1 U10.2(FB3)
NetC118_2: C118.2 R48.1 U10.10(EN1)
NetC119_2: C119.2 R52.1 U10.9(EN2)
NetC120_2: C120.2 R56.1 R65.2 U10.22(EN3)
NetC123_2: C123.2 R60.1 R64.1 U10.17(FB4)
NetC124_2: C124.2 R61.1 R68.1
NetJP1_1: JP1.1 R19.2
NetJP1_3: JP1.3 R20.2
NetJP1_5: JP1.5 R22.2
NetJP1_9: JP1.9 R23.2
NetL1_2: L1.2 U10.12(LX1)
NetL2_2: L2.2 U10.7(LX2)
NetL3_2: L3.2 U10.24(LX3)
NetL4_2: L4.2 U10.19(LX4)
NetLED1_2: LED1.2(K) R13.1
NetLED2_2: LED2.2(K) R31.1
NetLED3_2: LED3.2(K) R32.1
NetLED4_2: LED4.2(K) R66.1
NetR1_2: R1.2 R2.2 R3.2 U1.F8(MGTRREF_216)
NetR4_2: R4.2 R6.2 U1.D6(MGTAVCC) U1.D10(MGTAVCC) U1.E8(MGTAVCC) U1.F7(MGTAVCC) U1.F9(MGTAVCC)
NetR5_2: R5.2 R7.2 U1.B5(MGTAVTT) U1.B7(MGTAVTT) U1.B9(MGTAVTT) U1.B11(MGTAVTT) U1.C4(MGTAVTT) U1.C8(MGTAVTT)
NetR14_2: R14.2 U1.U12(INIT_B_0)
NetR21_1: R21.1 U8.6(CLK)
NetR57_2: R57.2 U9.L8(ZQ)
NetR65_1: R65.1 R68.2 U10.21(EN4)

Not connected (* = marked no-connect by the designer): JP1 6* 7* 8*; U1 AA9(NC)* AA10(NC)* AA11(NC)* AA13(NC)* AA14(NC)* AA15(NC)* AA16(NC)* AB10(NC)* AB11(NC)* AB12(NC)* AB13(NC)* AB15(NC)* AB16(NC)* AB17(NC)* E3(IO_L6N_T0_VREF_35)* G4(IO_L12N_T1_MRCC_35)* T14(NC)* T15(NC)* T16(NC)* U15(NC)* U16(NC)* V10(NC)* V13(NC)* V14(NC)* V15(NC)* W10(NC)* W11(NC)* W12(NC)* W14(NC)* W15(NC)* W16(NC)* Y11(NC)* Y12(NC)* Y13(NC)* Y14(NC)* Y16(NC)* Y17(NC)*; U6 4(BYP/ADJ)*; U7 4(BYP)*; U9 J1(NC)* J9(NC)* L1(NC)* L9(NC)* M7(NC)* T7(A14)*; U10 15(NC)* 16(NC)*; USBC1 A5(CC1)* A6(DP1)* A7(DN1)* A8(SBU1)* B5(CC2)* B6(DP2)* B7(DN2)* B8(SBU2)*; X1 1(EN/NC)*

## Notes on the sheet
- DDR
- 差分阻抗
- 单端阻抗
- (near U1) 差分阻抗
- VCCO_13
- VCCO_34
- VCINT
- IO
- (near R7) 网口
- VCCO_14
- VCCO_35
- 地址->
- QSPI时钟->
- (near X1) 有源晶振
- 配置完成信号->
- 启动模式配置->
- VCCO_15
- VCCO_16
- ~配置错误信号->
- 配置输入信号->
- Bank0电压配置->
- XADC->
- VCCAUX
- VCCO_0
- VCCO_BRAM
- (near U1) 启动配置
- VCCINT(1.0V)->VCCBRAM(1.0V)->VCCAUX-(1.8V)>VCCO(1.5V and 3.3V)
- VCCAUX（辅助电源）
- 地址信号->
- <-数据信号
- VCCINT（核心逻辑电源）
- VCCBRAM（Block RAM电源）
- Bank地址信号->
- <-数据同步信号
- 时钟信号->
- <-数据掩码信号
- 控制信号->
- <-复位信号
- 阻抗信号->
- <-阻抗控制
- 电源
- DDR3
- (in symbol CE_SMD) +
- (in symbol XC7A35T-2FGG484C, part A) BANK 14
- (in symbol XC7A35T-2FGG484C, part B) BANK 15
- (in symbol XC7A35T-2FGG484C, part C) BANK 16
- (in symbol XC7A35T-2FGG484C, part D) BANK 34
- (in symbol XC7A35T-2FGG484C, part E) BANK 35

## Library data of the parts
*1-*4 = M3: 铜柱孔
C1-C86 C91-C96 C98 C100 C102-C124 = C: 贴片电容/MLCC电容
E1 = CE_SMD: 贴片电解电容
FB1-FB3 = FB: 贴片磁珠
JP1 = Header 5X2: 5*2P接插件
L1-L4 = L-SMD: CD系列贴片线绕功率电感
LED1-LED4 = LED: 贴片LED
R1-R26 R28-R32 R34-R37 R39 R46 R48 R50 R52 R56 R57 R60 R61 R64-R66 R68 = R: 贴片电阻
SW1 = GT-TC029B-H020-L1N
TP1-TP5 = TEST: 测试点
U1 = XC7A35T-2FGG484C: Artix-7 FPGA, 250 User I/Os, 4 GTP, 484-Ball BGA, Speed Grade 2, Commercial Grade, Pb-Free
U8 = W25Q128: SPI FLASH
USBC1 = USB2.0_Type-C_16Pin: USB2.0_Type-C_16Pin母座
X1 = XTAL-ACT-4P: 4脚有源晶振(振荡器)